# EAGLE schematic Arch GPRS v2.0 (EAGLE 6.4)
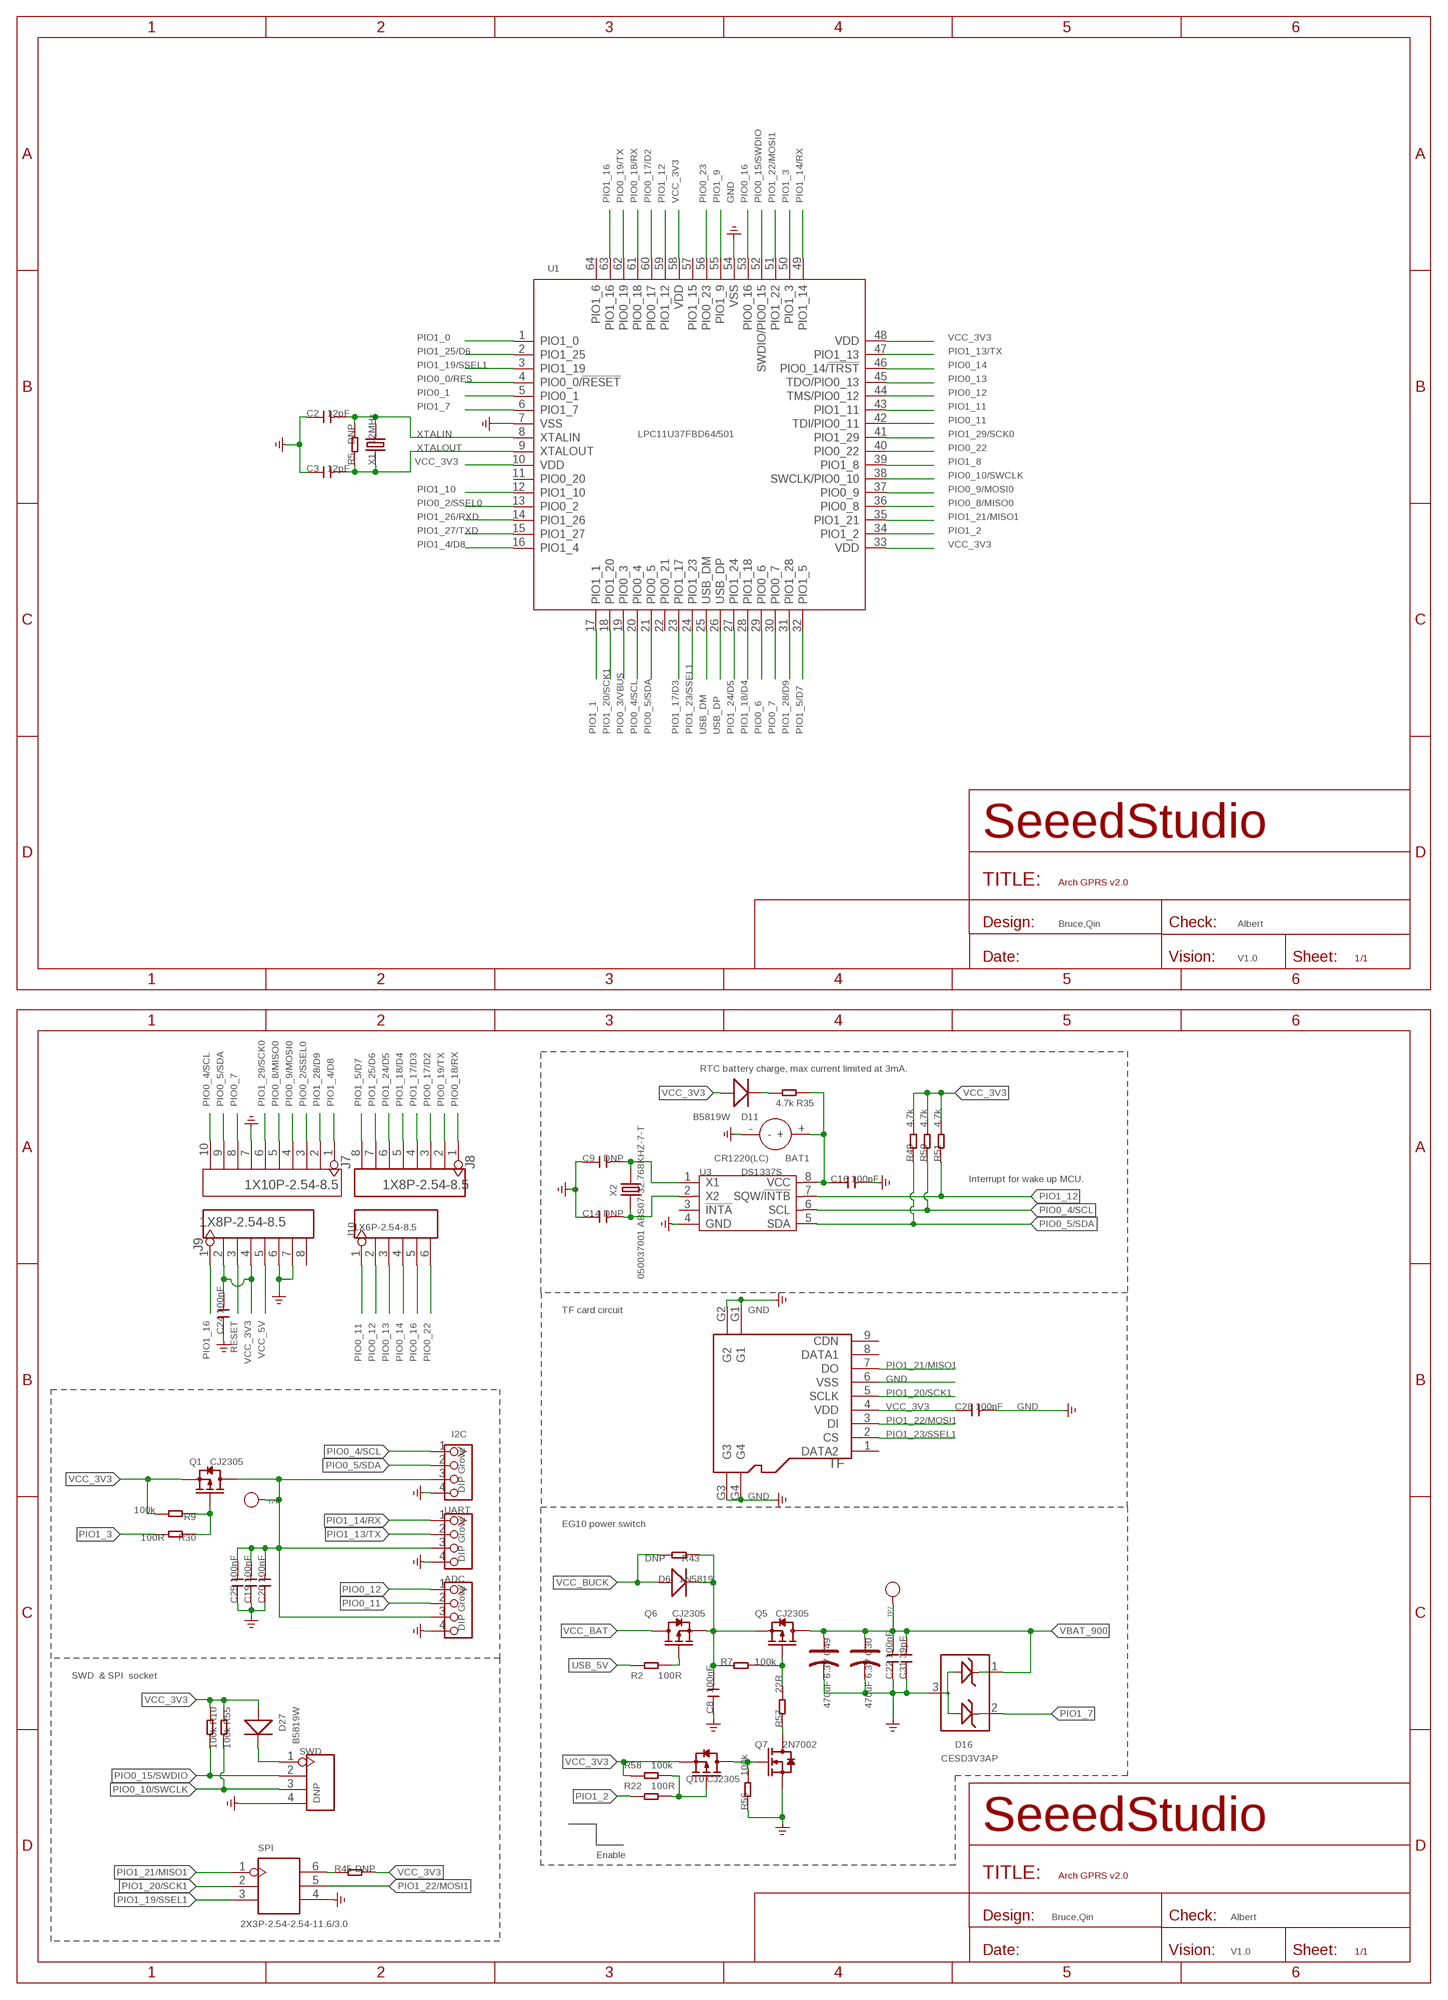
[diagram p0: schematic, sheet 1, part 1 of 2]
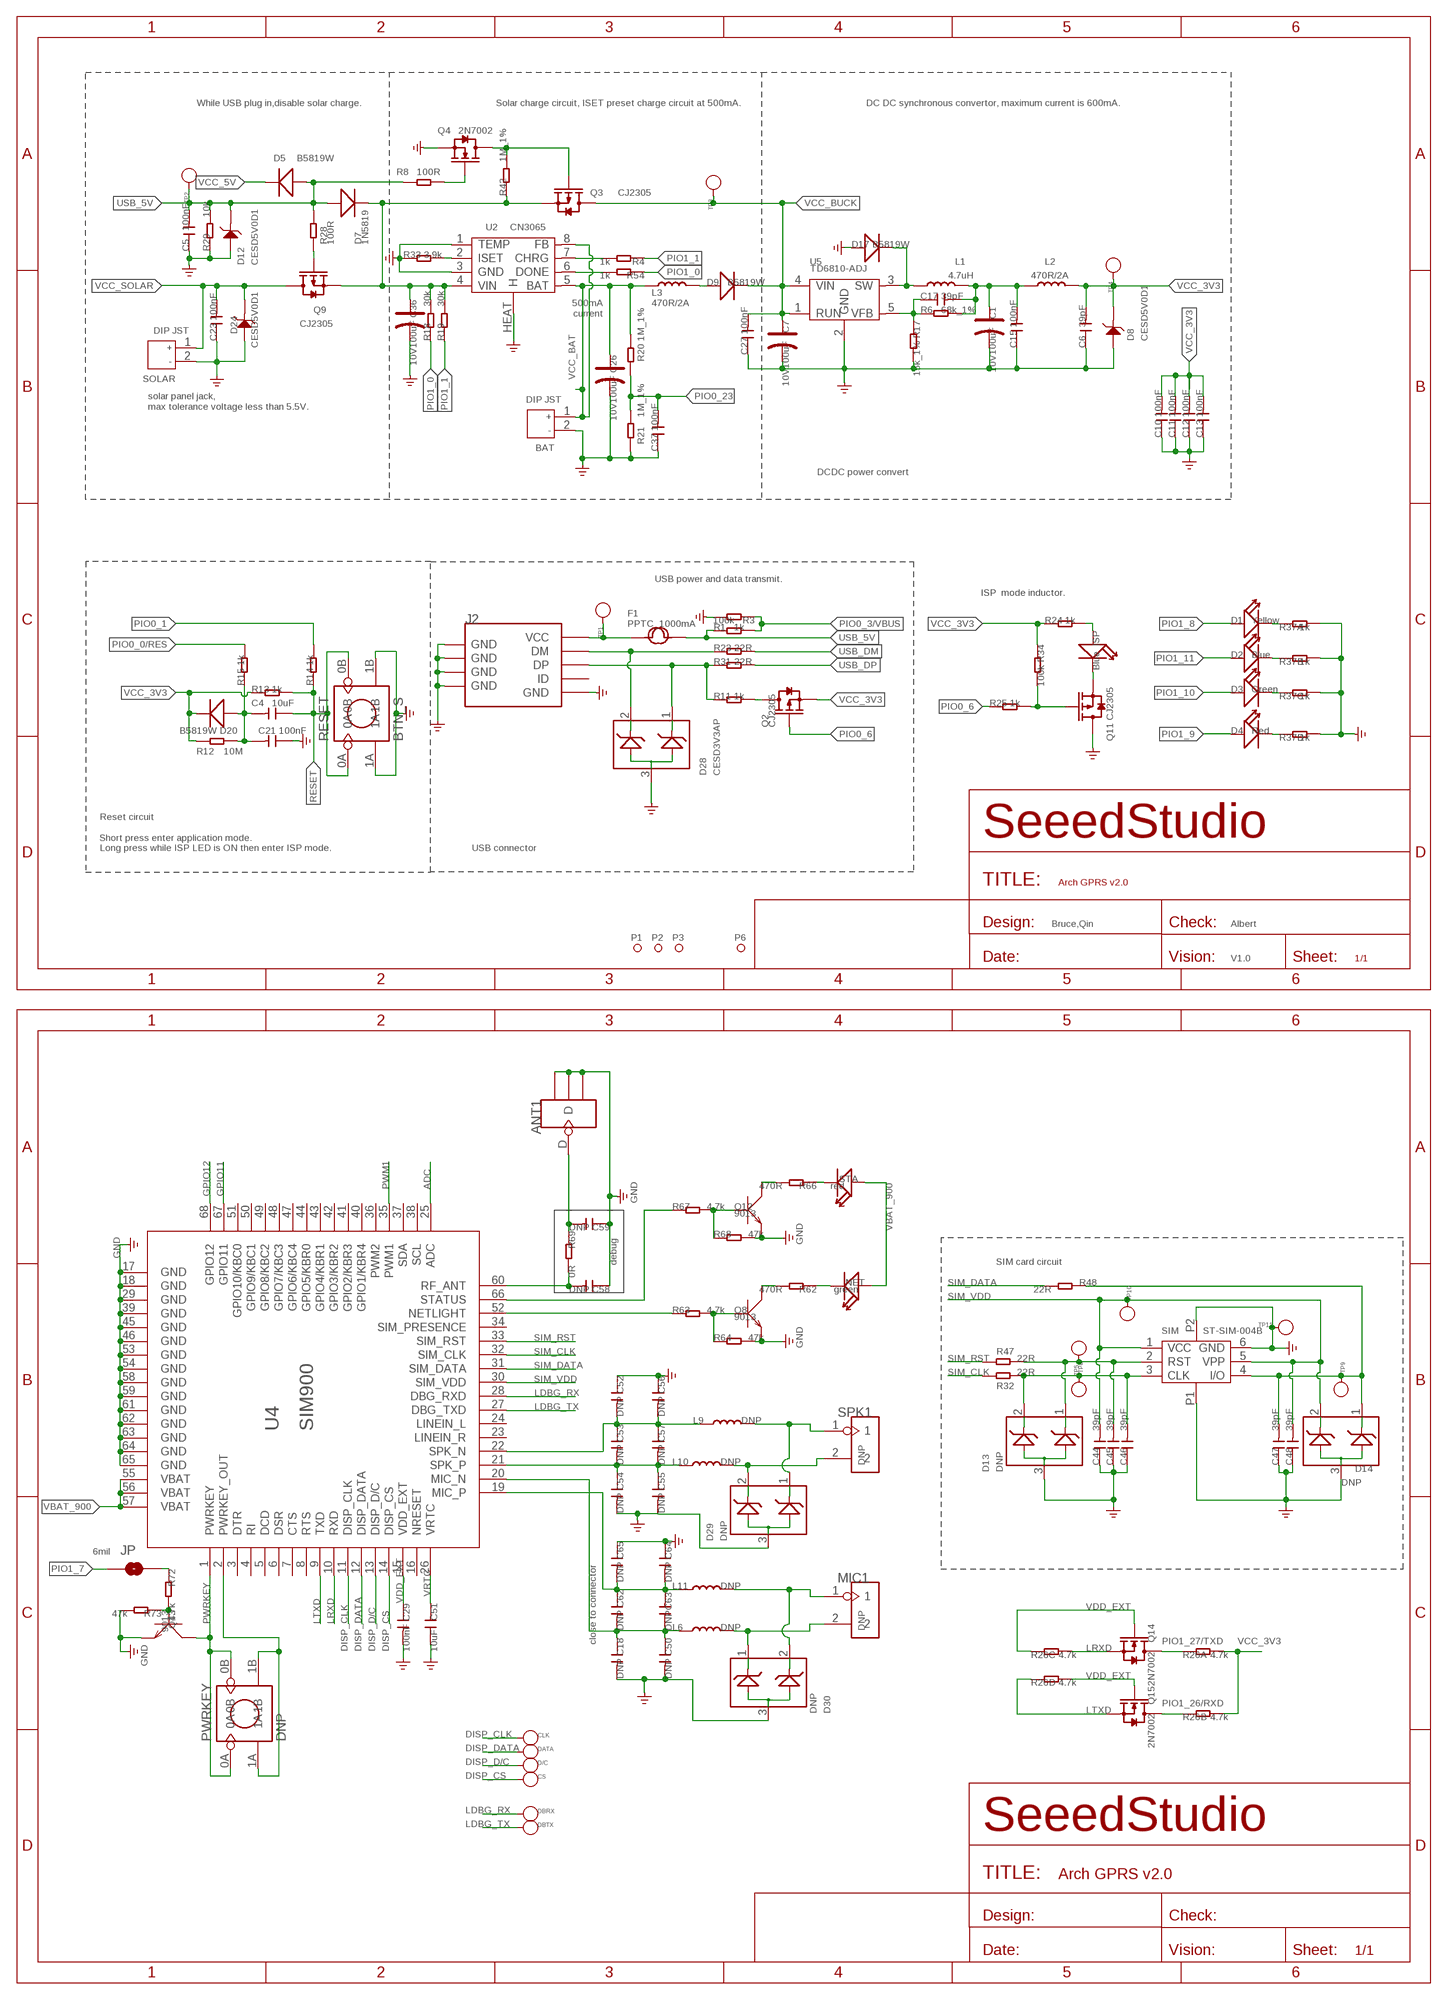
[diagram p1: schematic, sheet 1, part 2 of 2]

## Parts
ADC  DIP Grove  TWIG-4P-2.0-2.0  [4P-2.0]
ANT1  ANTENNA-U-FL  [4P-U-FL]
BAT  DIP JST  JACK-JST-2P-PW'2.0'  [JST-2.0]
BAT1  CR1220(LC)  BATTERY-3V  [2P-D12.55X2.22H]
C1  10V100uF  CAP-AVX-B  [AVX-B]
C2  12pF  C-0603  [C0603]
C3  12pF  C-0603  [C0603]
C4  10uF  C-0805  [C0805]
C5  100nF  C-0603  [C0603]
C6  39pF  C-0603  [C0603]
C7  10V100uF  CAP-AVX-B  [AVX-B]
C8  100nF  C-0603  [C0603]
C9  DNP  C-0603  [C0603]
C10  100nF  C-0603  [C0603]
C11  100nF  C-0603  [C0603]
C12  100nF  C-0603  [C0603]
C13  100nF  C-0603  [C0603]
C14  DNP  C-0603  [C0603]
C15  100nF  C-0603  [C0603]
C16  100nF  C-0603  [C0603]
C17  39pF  C-0603  [C0603]
C18  DNP  C-0603  [C0603]
C19  100nF  C-0603  [C0603]
C20  100nF  C-0603  [C0603]
C21  100nF  C-0603  [C0603]
C22  100nF  C-0603  [C0603]
C23  100nF  C-0603  [C0603]
C24  100nF  C-0603  [C0603]
C25  100nF  C-0603  [C0603]
C26  10V100uF  CAP-AVX-B  [AVX-B]
C27  100nF  C-0603  [C0603]
C28  100nF  C-0603  [C0603]
C29  100nF  C-0603  [C0603]
C30  470uF 6.3V  CAP-AVX-D  [AVX-D]
C31  39pF  C-0603  [C0603]
C36  10V100uF  CAP-AVX-B  [AVX-B]
C37  100nF  C-0603  [C0603]
C44  39pF  C-0603  [C0603]
C45  39pF  C-0603  [C0603]
C46  39pF  C-0603  [C0603]
C47  39pF  C-0603  [C0603]
C48  39pF  C-0603  [C0603]
C49  470uF 6.3V  CAP-AVX-D  [AVX-D]
C50  DNP  C-0603  [C0603]
C51  10uF  C-0805  [C0805]
C52  DNP  C-0603  [C0603]
C53  DNP  C-0603  [C0603]
C54  DNP  C-0603  [C0603]
C55  DNP  C-0603  [C0603]
C56  DNP  C-0603  [C0603]
C57  DNP  C-0603  [C0603]
C58  DNP  C-0603  [C0603]
C59  DNP  C-0603  [C0603]
C62  DNP  C-0603  [C0603]
C63  DNP  C-0603  [C0603]
C64  DNP  C-0603  [C0603]
C65  DNP  C-0603  [C0603]
CLK  PAD-TEST-POINT-CIRCLE'4545'  [TP_4545]
CS  PAD-TEST-POINT-CIRCLE'4545'  [TP_4545]
D1  Yellow  LED'0603'  [LED-0603]
D2  Blue  LED'0603'  [LED-0603]
D3  Green  LED'0603'  [LED-0603]
D4  Red  LED'0603'  [LED-0603]
D5  B5819W  D'1206'  [SOD123]
D6  1N5819  D'B130L-13-F'  [SMA]
D7  1N5819  D'B130L-13-F'  [SMA]
D8  CESD5V0D1  D-ESD-2P'CESD5V0D1'  [SOD123-2.7X1.6]
D9  B5819W  D'1206'  [SOD123]
D11  B5819W  D'1206'  [SOD123]
D12  CESD5V0D1  D-ESD-2P'CESD5V0D1'  [SOD123-2.7X1.6]
D13  DNP  D-ESD-3P  [SOT23]
D14  DNP  D-ESD-3P  [SOT23]
D16  CESD3V3AP  D-ESD-3P  [SOT23]
D17  B5819W  D'1206'  [SOD123]
D20  B5819W  D'1206'  [SOD123]
D24  CESD5V0D1  D-ESD-2P'CESD5V0D1'  [SOD123-2.7X1.6]
D27  B5819W  D'1206'  [SOD123]
D28  CESD3V3AP  D-ESD-3P  [SOT23]
D29  DNP  D-ESD-3P  [SOT23]
D30  DNP  D-ESD-3P  [SOT23]
D/C  PAD-TEST-POINT-CIRCLE'4545'  [TP_4545]
DATA  PAD-TEST-POINT-CIRCLE'4545'  [TP_4545]
DBRX  DBURX  PAD-TEST-POINT-CIRCLE'4545'  [TP_4545]
DBTX  PAD-TEST-POINT-CIRCLE'4545'  [TP_4545]
F1  PPTC_1000mA  FUSE'1206'  [F1206]
I2C  DIP Grove  TWIG-4P-2.0-2.0  [4P-2.0]
ISP  Blue  LED'0603'  [LED-0603]
J2  USB-MINIUSB-5P-MICRO  [MICRO-USB]
J7  1X10P-2.54-8.5  HEADER-10P-2.54  [10P-2.54]
J8  1X8P-2.54-8.5  HEADER-8P-2.54  [8P-2.54]
J9  1X8P-2.54-8.5  HEADER-8P-2.54  [8P-2.54]
J10  1X6P-2.54-8.5  HEADER-6P-65/35MIL  [6P-2.54-65/35MIL]
JP  PAD-SOLDERJUMPERNC  [2P-SMD-3.3X2]
L1  4.7uH  LSPD3D16-4R7M  [L0420]
L2  470R/2A  L'0805'  [L0805]
L3  470R/2A  L'0805'  [L0805]
L6  DNP  L'0603'  [L0603]
L9  DNP  L'0603'  [L0603]
L10  DNP  L'0603'  [L0603]
L11  DNP  L'0603'  [L0603]
MIC1  DNP  HEADER-2P-2.0  [2P-2.0]
NET  green  LED'0603'  [LED-0603]
P1  PAD-MARK  [ROUND-MARK-1.0]
P2  PAD-MARK  [ROUND-MARK-1.0]
P3  PAD-MARK  [ROUND-MARK-1.0]
P6  PAD-MARK  [ROUND-MARK-1.0]
PWRKEY  DNP  BTN_S  [BTN_S]
Q1  CJ2305  MOSFET-P'SI2323CDS/SI2305DS<BR>'  [SOT23]
Q2  CJ2305  MOSFET-P'SI2323CDS/SI2305DS<BR>'  [SOT23]
Q3  CJ2305  MOSFET-P'SI2323CDS/SI2305DS<BR>'  [SOT23]
Q4  2N7002  MOSFET-N'SOT23'  [SOT23]
Q5  CJ2305  MOSFET-P'SI2323CDS/SI2305DS<BR>'  [SOT23]
Q6  CJ2305  MOSFET-P'SI2323CDS/SI2305DS<BR>'  [SOT23]
Q7  2N7002  MOSFET-N'SOT23'  [SOT23]
Q8  9013  TRANSISTOR-NPN-SOT23  [SOT23]
Q9  CJ2305  MOSFET-P'SI2323CDS/SI2305DS<BR>'  [SOT23]
Q10  CJ2305  MOSFET-P'SI2323CDS/SI2305DS<BR>'  [SOT23]
Q11  CJ2305  MOSFET-P'SI2323CDS/SI2305DS<BR>'  [SOT23]
Q12  9013  TRANSISTOR-NPN-SOT23  [SOT23]
Q13  9013  TRANSISTOR-NPN-SOT23  [SOT23]
Q14  2N7002  MOSFET-N'SOT23'  [SOT23]
Q15  2N7002  MOSFET-N'SOT23'  [SOT23]
R1  1k  R-0603  [R0603]
R2  100R  R-0603  [R0603]
R3  100k  R-0603  [R0603]
R4  1k  R-0603  [R0603]
R5  DNP  R-0603  [R0603]
R6  68k_1%  R-0603  [R0603]
R7  100k  R-0603  [R0603]
R8  100R  R-0603  [R0603]
R9  100k  R-0603  [R0603]
R10  100k  R-0603  [R0603]
R11  1k  R-0603  [R0603]
R12  10M  R-0603  [R0603]
R13  1k  R-0603  [R0603]
R14  1k  R-0603  [R0603]
R15  1k  R-0603  [R0603]
R17  15k_1%  R-0603  [R0603]
R18  30k  R-0603  [R0603]
R19  30k  R-0603  [R0603]
R20  1M_1%  R-0603  [R0603]
R21  1M_1%  R-0603  [R0603]
R22  100R  R-0603  [R0603]
R23  22R  R-0603  [R0603]
R24  1k  R-0603  [R0603]
R25  1k  R-0603  [R0603]
R26  4.7k  R-4R-1206  [1206-8-3.3X2.4]
R28  100R  R-0603  [R0603]
R29  10k  R-0603  [R0603]
R30  100R  R-0603  [R0603]
R31  22R  R-0603  [R0603]
R32  22R  R-0603  [R0603]
R33  3.9k  R-0603  [R0603]
R34  100k  R-0603  [R0603]
R35  4.7k  R-0603  [R0603]
R37  1k  R-4R-1206  [1206-8-3.3X2.4]
R42  1M_1%  R-0603  [R0603]
R43  DNP  R-0603  [R0603]
R45  DNP  R-0603  [R0603]
R47  22R  R-0603  [R0603]
R48  22R  R-0603  [R0603]
R49  4.7k  R-0603  [R0603]
R50  4.7k  R-0603  [R0603]
R51  4.7k  R-0603  [R0603]
R54  1k  R-0603  [R0603]
R55  100k  R-0603  [R0603]
R56  100k  R-0603  [R0603]
R57  22R  R-0603  [R0603]
R58  100k  R-0603  [R0603]
R62  470R  R-0603  [R0603]
R63  4.7k  R-0603  [R0603]
R64  47k  R-0603  [R0603]
R66  470R  R-0603  [R0603]
R67  4.7k  R-0603  [R0603]
R68  47k  R-0603  [R0603]
R69  0R  R-0603  [R0603]
R72  4.7k  R-0603  [R0603]
R73  47k  R-0603  [R0603]
RESET  BTN_S  [BTN_S]
SIM  ST-SIM-004B  SIM-CARD'ST-SIM-004B'  [6P-1.8]
SOLAR  DIP JST  JACK-JST-2P-PW'2.0'  [JST-2.0]
SPI  2X3P-2.54-2.54-11.6/3.0  HEADER-2X3P-2.54  [2X3P-2.54]
SPK1  DNP  HEADER-2P-2.0  [2P-2.0]
STA  red  LED'0603'  [LED-0603]
SWD  DNP  HEADER-4P-65/35MIL  [4P-65/35MIL]
TF  HOLDER-MICROSD-9P'HOLDER'  [9P-SMD-W/-RING]
TP1  PAD-TEST-POINT'4545'  [TP_4545]
TP2  PAD-TEST-POINT'4545'  [TP_4545]
TP3  PAD-TEST-POINT'4545'  [TP_4545]
TP4  PAD-TEST-POINT'4545'  [TP_4545]
TP5  PAD-TEST-POINT'4545'  [TP_4545]
TP6  PAD-TEST-POINT'4545'  [TP_4545]
TP7  PAD-TEST-POINT'4545'  [TP_4545]
TP8  PAD-TEST-POINT'4545'  [TP_4545]
TP9  PAD-TEST-POINT'4545'  [TP_4545]
TP10  PAD-TEST-POINT'4545'  [TP_4545]
TP11  PAD-TEST-POINT'4545'  [TP_4545]
U1  LPC11U37FBD64/501  [LQFP64]
U2  CN3065  CN3065-DFN8  [DFN8]
U3  DS1337S  [SOP8]
U4  SIM900  [SIM900]
U5  TD6810-ADJ  TD6810'TSOT23-5'  [SOT23-5]
UART  DIP Grove  TWIG-4P-2.0-2.0  [4P-2.0]
X1  12MHz  CRYSTAL'5032'  [2P-SMD-5X3.2]
X2  050037001 ABS07-32.768KHZ-7-T  CRYSTAL-3215  [2P-SMD-3.2X1.5]

## Nets
ADC: U4.25(ADC)
DISP_CLK: CLK.T U4.11(DISP_CLK)
DISP_CS: CS.T U4.14(DISP_CS)
DISP_D/C: D/C.T U4.13(DISP_D/C)
DISP_DATA: DATA.T U4.12(DISP_DATA)
EG10_SIM_CLK: C46.2 D13.2 R32.1 SIM.3(CLK) TP8.T
EG10_SIM_IO: C47.2 D14.1 R48.1 SIM.4(I/O) TP9.T
EG10_SIM_RST: C45.2 D13.1 R47.1 SIM.2(RST) TP5.T
GND: ADC.4 ANT1.GND1 ANT1.GND2 ANT1.GND3 BAT1.- BAT.2 C1.- C2.1 C3.1 C5.1 C6.1 C7.- C8.1 C9.1 C10.1 C11.1 C12.1 C13.1 C14.1 C15.1 C16.2 C18.2 C19.1 C20.1 C21.1 C22.1 C23.1 C24.1 C25.1 C26.- C27.1 C28.2 C29.2 C30.- C31.1 C36.- C37.1 C44.1 C45.1 C46.1 C47.1 C48.1 C49.- C50.2 C51.1 C52.1 C54.2 C55.2 C56.1 C58.1 C59.1 C64.1 C65.1 D8.1 D12.1 D13.3 D14.3 D16.3 D17.+ D24.1 D28.3 D29.3 D30.3 I2C.4 J2.5(GND) J2.S1(GND) J2.S2(GND) J2.S3(GND) J2.S4(GND) J2.S5(GND) J2.S6(GND) J7.7 J9.6 J9.7 Q4.2(S) Q7.2(S) Q8.2(E) Q11.3(D) Q12.2(E) Q13.2(E) R3.2 R17.2 R21.1 R29.1 R33.1 R37.5 R37.6 R37.7 R37.8 R56.1 R64.2 R68.2 R73.2 RESET.1A RESET.1B SIM.6(GND) SIM.P1 SIM.P2 SOLAR.2 SPI.4 SWD.4 TF.6(VSS) TF.G1 TF.G2 TF.G3 TF.G4 TP11.T U1.7(VSS) U1.54(VSS) U2.1(TEMP) U2.3(GND) U2.HEAT(H) U3.4(GND) U4.17(GND) U4.18(GND) U4.29(GND) U4.39(GND) U4.45(GND) U4.46(GND) U4.53(GND) U4.54(GND) U4.58(GND) U4.59(GND) U4.61(GND) U4.62(GND) U4.63(GND) U4.64(GND) U4.65(GND) U5.2(GND) UART.4
GPIO11: U4.67(GPIO11)
GPIO12: U4.68(GPIO12)
LDBG_RX: DBRX.T U4.28(DBG_RXD)
LDBG_TX: DBTX.T U4.27(DBG_TXD)
LRXD: Q14.2(S) R26.3 U4.10(RXD)
LTXD: Q15.2(S) R26.4 U4.9(TXD)
N$1: D27.- SWD.1
N$2: D4.- R37.4
N$3: Q2.3(D) R11.2
N$4: Q5.1(G) R7.2 R57.2
N$5: R33.2 U2.2(ISET)
N$6: D11.- R35.1
N$7: C4.2 C21.2 D20.+ R12.2 R15.1
N$8: Q3.1(G) Q4.3(D) R42.2
N$9: C8.2 D6.1(-) Q5.2(S) Q6.2(S) R7.1 R43.1
N$10: D9.+ L3.2
N$11: JP.2 R72.1
N$12: Q1.1(G) R9.1 R30.1
N$13: C14.2 U3.2(X2) X2.1
N$14: C9.2 U3.1(X1) X2.2
N$15: Q11.1(G) R25.2 R34.2
N$16: ISP.- Q11.2(S)
N$17: D3.- R37.3
N$18: ISP.+ R24.2
N$19: D2.- R37.2
N$20: C18.1 C50.1 C62.2 C63.1 L6.1 U4.20(MIC_N)
N$23: R45.1 SPI.6
N$24: BAT1.+ C16.1 R35.2 U3.8(VCC)
N$25: D30.1 L6.2 MIC1.2
N$26: D30.2 L11.2 MIC1.1
N$27: Q6.1(G) R2.1
N$28: D1.- R37.1
N$29: D17.- L1.1 U5.3(SW)
N$30: D29.1 L9.2 SPK1.1
N$33: Q9.1(G) R28.1
N$35: D28.2 J2.2(DM) R23.1
N$36: D28.1 J2.3(DP) R11.1 R31.1
N$37: C36.+ D7.1(-) Q3.2(S) Q9.2(S) R18.2 R19.2 R42.1 U2.4(VIN)
N$38: F1.1 J2.1(VCC) TP1.T
N$39: C17.1 R6.1 R17.1 U5.5(VFB)
N$40: Q4.1(G) R8.1
N$43: R4.2 U2.7(CHRG)
N$44: R54.2 U2.6(DONE)
N$45: Q7.3(D) R57.1
N$46: Q7.1(G) Q10.3(D) R56.2
N$47: C1.+ C15.2 C17.2 L1.2 L2.1 R6.2
N$48: Q10.1(G) R22.1 R58.1
N$49: Q8.3(C) R62.2
N$50: NET.- R62.1
N$51: Q8.1(B) R63.2 R64.1
N$52: R63.1 U4.52(NETLIGHT)
N$53: C53.2 C54.1 C55.1 C57.2 L10.1 U4.21(SPK_P)
N$54: C52.2 C53.1 C56.2 C57.1 L9.1 U4.22(SPK_N)
N$55: Q12.3(C) R66.2
N$56: R66.1 STA.-
N$57: Q12.1(B) R67.2 R68.1
N$58: R67.1 U4.66(STATUS)
N$59: C58.2 R69.2 U4.60(RF_ANT)
N$60: ANT1.D C59.2 R69.1
N$61: C62.1 C63.2 C64.2 C65.2 L11.1 U4.19(MIC_P)
N$63: Q13.1(B) R72.2 R73.1
N$64: PWRKEY.1A PWRKEY.1B U4.2(PWRKEY_OUT)
N$92: D29.2 L10.2 SPK1.2
PIO0_0/RES: R15.2 U1.4(PIO0_0/!RESET)
PIO0_1: R14.2 U1.5(PIO0_1)
PIO0_2/SSEL0: J7.3 U1.13(PIO0_2)
PIO0_3/VBUS: R1.2 R3.1 U1.19(PIO0_3)
PIO0_4/SCL: I2C.1 J7.10 R50.1 U1.20(PIO0_4) U3.6(SCL)
PIO0_5/SDA: I2C.2 J7.9 R49.1 U1.21(PIO0_5) U3.5(SDA)
PIO0_6: Q2.1(G) R25.1 U1.29(PIO0_6)
PIO0_7: J7.8 U1.30(PIO0_7)
PIO0_8/MISO0: J7.5 U1.36(PIO0_8)
PIO0_9/MOSI0: J7.4 U1.37(PIO0_9)
PIO0_10/SWCLK: R55.2 SWD.3 U1.38(SWCLK/PIO0_10)
PIO0_11: ADC.2 J10.1 U1.42(TDI/PIO0_11)
PIO0_12: ADC.1 J10.2 U1.44(TMS/PIO0_12)
PIO0_13: J10.3 U1.45(TDO/PIO0_13)
PIO0_14: J10.4 U1.46(PIO0_14/!TRST)
PIO0_15/SWDIO: R10.2 SWD.2 U1.52(SWDIO/PIO0_15)
PIO0_16: J10.5 U1.53(PIO0_16)
PIO0_17/D2: J8.3 U1.60(PIO0_17)
PIO0_18/RX: J8.1 U1.61(PIO0_18)
PIO0_19/TX: J8.2 U1.62(PIO0_19)
PIO0_22: J10.6 U1.40(PIO0_22)
PIO0_23: C37.2 R20.1 R21.2 U1.56(PIO0_23)
PIO1_0: R18.1 R54.1 U1.1(PIO1_0)
PIO1_1: R4.1 R19.1 U1.17(PIO1_1)
PIO1_2: R22.2 U1.34(PIO1_2)
PIO1_3: R30.2 U1.50(PIO1_3)
PIO1_4/D8: J7.1 U1.16(PIO1_4)
PIO1_5/D7: J8.8 U1.32(PIO1_5)
PIO1_7: D16.2 JP.1 U1.6(PIO1_7)
PIO1_8: D1.+ U1.39(PIO1_8)
PIO1_9: D4.+ U1.55(PIO1_9)
PIO1_10: D3.+ U1.12(PIO1_10)
PIO1_11: D2.+ U1.43(PIO1_11)
PIO1_12: R51.1 U1.59(PIO1_12) U3.7(SQW/!INTB)
PIO1_13/TX: U1.47(PIO1_13) UART.2
PIO1_14/RX: U1.49(PIO1_14) UART.1
PIO1_16: J9.1 U1.63(PIO1_16)
PIO1_17/D3: J8.4 U1.23(PIO1_17)
PIO1_18/D4: J8.5 U1.28(PIO1_18)
PIO1_19/SSEL1: SPI.3 U1.3(PIO1_19)
PIO1_20/SCK1: SPI.2 TF.5(SCLK) U1.18(PIO1_20)
PIO1_21/MISO1: SPI.1 TF.7(DO) U1.35(PIO1_21)
PIO1_22/MOSI1: SPI.5 TF.3(DI) U1.51(PIO1_22)
PIO1_23/SSEL1: TF.2(CS) U1.24(PIO1_23)
PIO1_24/D5: J8.6 U1.27(PIO1_24)
PIO1_25/D6: J8.7 U1.2(PIO1_25)
PIO1_26/RXD: Q15.3(D) R26.2 U1.14(PIO1_26)
PIO1_27/TXD: Q14.3(D) R26.1 U1.15(PIO1_27)
PIO1_28/D9: J7.2 U1.31(PIO1_28)
PIO1_29/SCK0: J7.6 U1.41(PIO1_29)
PWM1: U4.35(PWM1)
PWRKEY: PWRKEY.0A PWRKEY.0B Q13.3(C) U4.1(PWRKEY)
RESET: C4.1 J9.3 R13.2 R14.1 RESET.0A RESET.0B
SIM_CLK: R32.2 U4.32(SIM_CLK)
SIM_DATA: R48.2 U4.31(SIM_DATA)
SIM_RST: R47.2 U4.33(SIM_RST)
SIM_VDD: C44.2 C48.2 D14.2 SIM.1(VCC) SIM.5(VPP) TP10.T U4.30(SIM_VDD)
USB_5V: C5.2 D5.+ D7.2(+) D12.2 F1.2 R1.1 R2.2 R8.2 R28.2 R29.2 TP2.T
USB_DM: R23.2 U1.25(USB_DM)
USB_DP: R31.2 U1.26(USB_DP)
VBAT_900: C22.2 C30.+ C31.2 C49.+ D16.1 NET.+ Q5.3(D) STA.+ TP7.T U4.55(VBAT) U4.56(VBAT) U4.57(VBAT)
VCC_3V3: C6.2 C10.2 C11.2 C12.2 C13.2 C24.2 C28.1 D8.2 D11.+ D20.- D27.+ J9.2 J9.4 L2.2 Q1.2(S) Q2.2(S) Q10.2(S) R9.2 R10.1 R12.1 R13.1 R24.1 R26.7 R26.8 R34.1 R45.2 R49.2 R50.2 R51.2 R55.1 R58.2 TF.4(VDD) TP4.T U1.10(VDD) U1.33(VDD) U1.48(VDD) U1.58(VDD)
VCC_5V: D5.- J9.5
VCC_BAT: BAT.1 C26.+ L3.1 Q6.3(D) R20.2 U2.5(BAT) U2.8(FB)
VCC_BUCK: C7.+ C27.2 D6.2(+) D9.- Q3.3(D) R43.2 TP3.T U5.1(RUN) U5.4(VIN)
VCC_G: ADC.3 C19.2 C20.2 C25.2 I2C.3 Q1.3(D) TP6.T UART.3
VCC_SOLAR: C23.2 D24.2 Q9.3(D) SOLAR.1
VDD_EXT: C29.1 Q14.1(G) Q15.1(G) R26.5 R26.6 U4.15(VDD_EXT)
VRTC: C51.2 U4.26(VRTC)
XTALIN: C2.2 R5.2 U1.8(XTALIN) X1.2
XTALOUT: C3.2 R5.1 U1.9(XTALOUT) X1.1
Unconnected: J2.4(ID) J9.8 TF.1(DATA2) TF.8(DATA1) TF.9(CDN) U1.11(PIO0_20) U1.22(PIO0_21) U1.57(PIO1_15) U1.64(PIO1_6) U3.3(!INTA) U4.3(DTR) U4.4(RI) U4.5(DCD) U4.6(DSR) U4.7(CTS) U4.8(RTS) U4.16(NRESET) U4.23(LINEIN_R) U4.24(LINEIN_L) U4.34(SIM_PRESENCE) U4.36(PWM2) U4.37(SDA) U4.38(SCL) U4.40(GPIO1/KBR4) U4.41(GPIO2/KBR3) U4.42(GPIO3/KBR2) U4.43(GPIO4/KBR1) U4.44(GPIO5/KBR0) U4.47(GPIO6/KBC4) U4.48(GPIO7/KBC3) U4.49(GPIO8/KBC2) U4.50(GPIO9/KBC1) U4.51(GPIO10/KBC0)

## Notes on the sheet
- While USB plug in,disable solar charge. | Solar charge circuit, ISET preset charge circuit at 500mA. | DC DC synchronous convertor, maximum current is 600mA.
- 500mA
  current
- solar panel jack, 
  max tolerance voltage less than 5.5V.
- DCDC power convert
- USB power and data transmit.
- ISP  mode inductor.
- Reset circuit
  
  Short press enter application mode.
  Long press while ISP LED is ON then enter ISP mode.
- USB connector
- Bruce,Qin | Albert | Bruce,Qin | Albert
- V1.0 | V1.0
- RTC battery charge, max current limited at 3mA.
- Interrupt for wake up MCU.
- debug | SIM card circuit
- TF card circuit
- EG10 power switch
- 6mil
- close to connector
- SWD  & SPI  socket
- Enable
- Bruce,Qin | Albert
- V1.0

## Library data of the parts
ADC I2C UART = Connector:TWIG-4P-2.0
ANT1 = Connector:ANTENNA-U-FL
BAT SOLAR = Connector :JACK-JST-2P-PW
BAT1 = template:BATTERY-3V
C1 C7 C26 C30 C36 C49 = Discrete:CAP*: Electrolytic Capacitors,Tantalum Capacitors and Super Capacitors
C2-C6 C8-C25 C27-C29 C31 C37 C44-C48 C50-C59 C62-C65 = Discrete:C*: Ceramic Capacitors
CLK CS D/C DATA DBRX DBTX = Discrete:PAD-TEST-POINT-CIRCLE; PARTNO: DNP
D1-D4 ISP NET STA = Discrete:LED*
D5-D7 D9 D11 D17 D20 D27 = Discrete:D*
D8 D12 D24 = Discrete:D-ESD-2P: Diodes for Protectiong against ESD
D13 D14 D16 D28-D30 = Discrete:D-ESD-3P
F1 = Discrete:FUSE
J2 = Connector :USB-MINIUSB-5P
J7 = Connector :HEADER-10P
J8 J9 = Connector :HEADER-8P
J10 = Connector :HEADER-6P
JP = Discrete:PAD-SOLDERJUMPER: Solder Jumper Standard SMD solder jumper. Used to automate production. Two varients : Normally Open and Normally Closed are the same, but have different paste layers. NC will have a large amount of paste and should jumper during reflow.
L1 = template:L
L2 L3 L6 L9-L11 = Discrete:L*
MIC1 SPK1 = Connector :HEADER-2P
P1-P3 P6 = Discrete:PAD-MARK; PARTNO: DNP
PWRKEY RESET = CPT_SMD:BTN_S
Q1-Q3 Q5 Q6 Q9-Q11 = Discrete:MOSFET-P
Q4 Q7 Q14 Q15 = Discrete:MOSFET-N: IRLL014: http://www.vishay.com/docs/91319/sihll014.pdf
Q8 Q12 Q13 = Discrete:TRANSISTOR-NPN*: NPN audion
R1-R15 R17-R25 R28-R35 R42 R43 R45 R47-R51 R54-R58 R62-R64 R66-R69 R72 R73 = Discrete:R*
R26 R37 = Discrete:R-4R*: Resistor Array
SIM = template:SIM-CARD
SPI = Connector :HEADER-2X3P
SWD = Connector :HEADER-4P
TF = Connector:HOLDER-MICROSD-9P
TP1-TP11 = Discrete:PAD-TEST-POINT; PARTNO: DNP
U1 = template :LPC11U37FBD64/501: 32-bit ARM Cortex-M0 microcontroller; up to 128 kB flash; up to 12 kB SRAM and 4 kB EEPROM; USB device; USART
U2 = IC:CN3065: USB-Compatible Lithiumt-Ion Battery Charger with Thermal Regulation http://www.consonance-elec.com/pdf/%E6%8A%80%E6%9C%AF%E8%AF%B4%E6%98%8E%E4%B9%A6/DSC-CN3065.pdf
U3 = For_Test_Albert:DS1337: I2C Serial Real-Time clock http://datasheets.maximintegrated.com/en/ds/DS1337-DS1337C.pdf
U4 = ICs_v54:SIM900
U5 = template:TD6810: 1.5MHz 800mA Synchronous Step-Down Regulator Dropout http://www.techcodeok.com/download/TD6810.pdf
X1 X2 = Discrete:CRYSTAL*: CRYSTAL

## Net classes
0 default: width 0.102 mm, drill 0.203 mm, clearance 0.102 mm